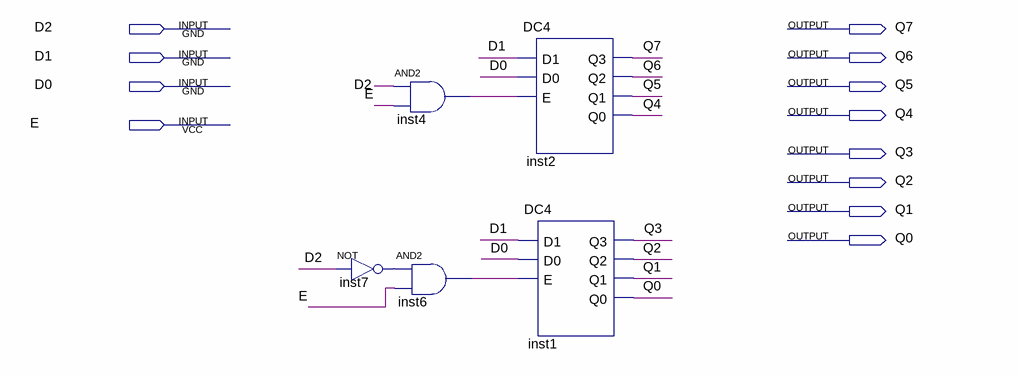
[diagram p0: schematic sheet]
// Quartus schematic DC8.bdf as structural Verilog: 5 symbols, 12 pins
module DC8 (
  input  D2,
  input  D1,
  input  D0,
  input  E,
  output Q7,
  output Q6,
  output Q5,
  output Q4,
  output Q3,
  output Q2,
  output Q1,
  output Q0
);

  wire inst4_out, inst6_out, inst7_out;

  not inst7 (inst7_out, D2);
  and inst4 (inst4_out, D2, E);
  and inst6 (inst6_out, inst7_out, E);
  DC4 inst2 (.D1(D1), .D0(D0), .E(inst4_out), .Q3(Q7), .Q2(Q6), .Q1(Q5), .Q0(Q4));
  DC4 inst1 (.D1(D1), .D0(D0), .E(inst6_out), .Q3(Q3), .Q2(Q2), .Q1(Q1), .Q0(Q0));
endmodule
